# Altium project MiniPC MB GOST.PrjPcb (part 17 of 31)
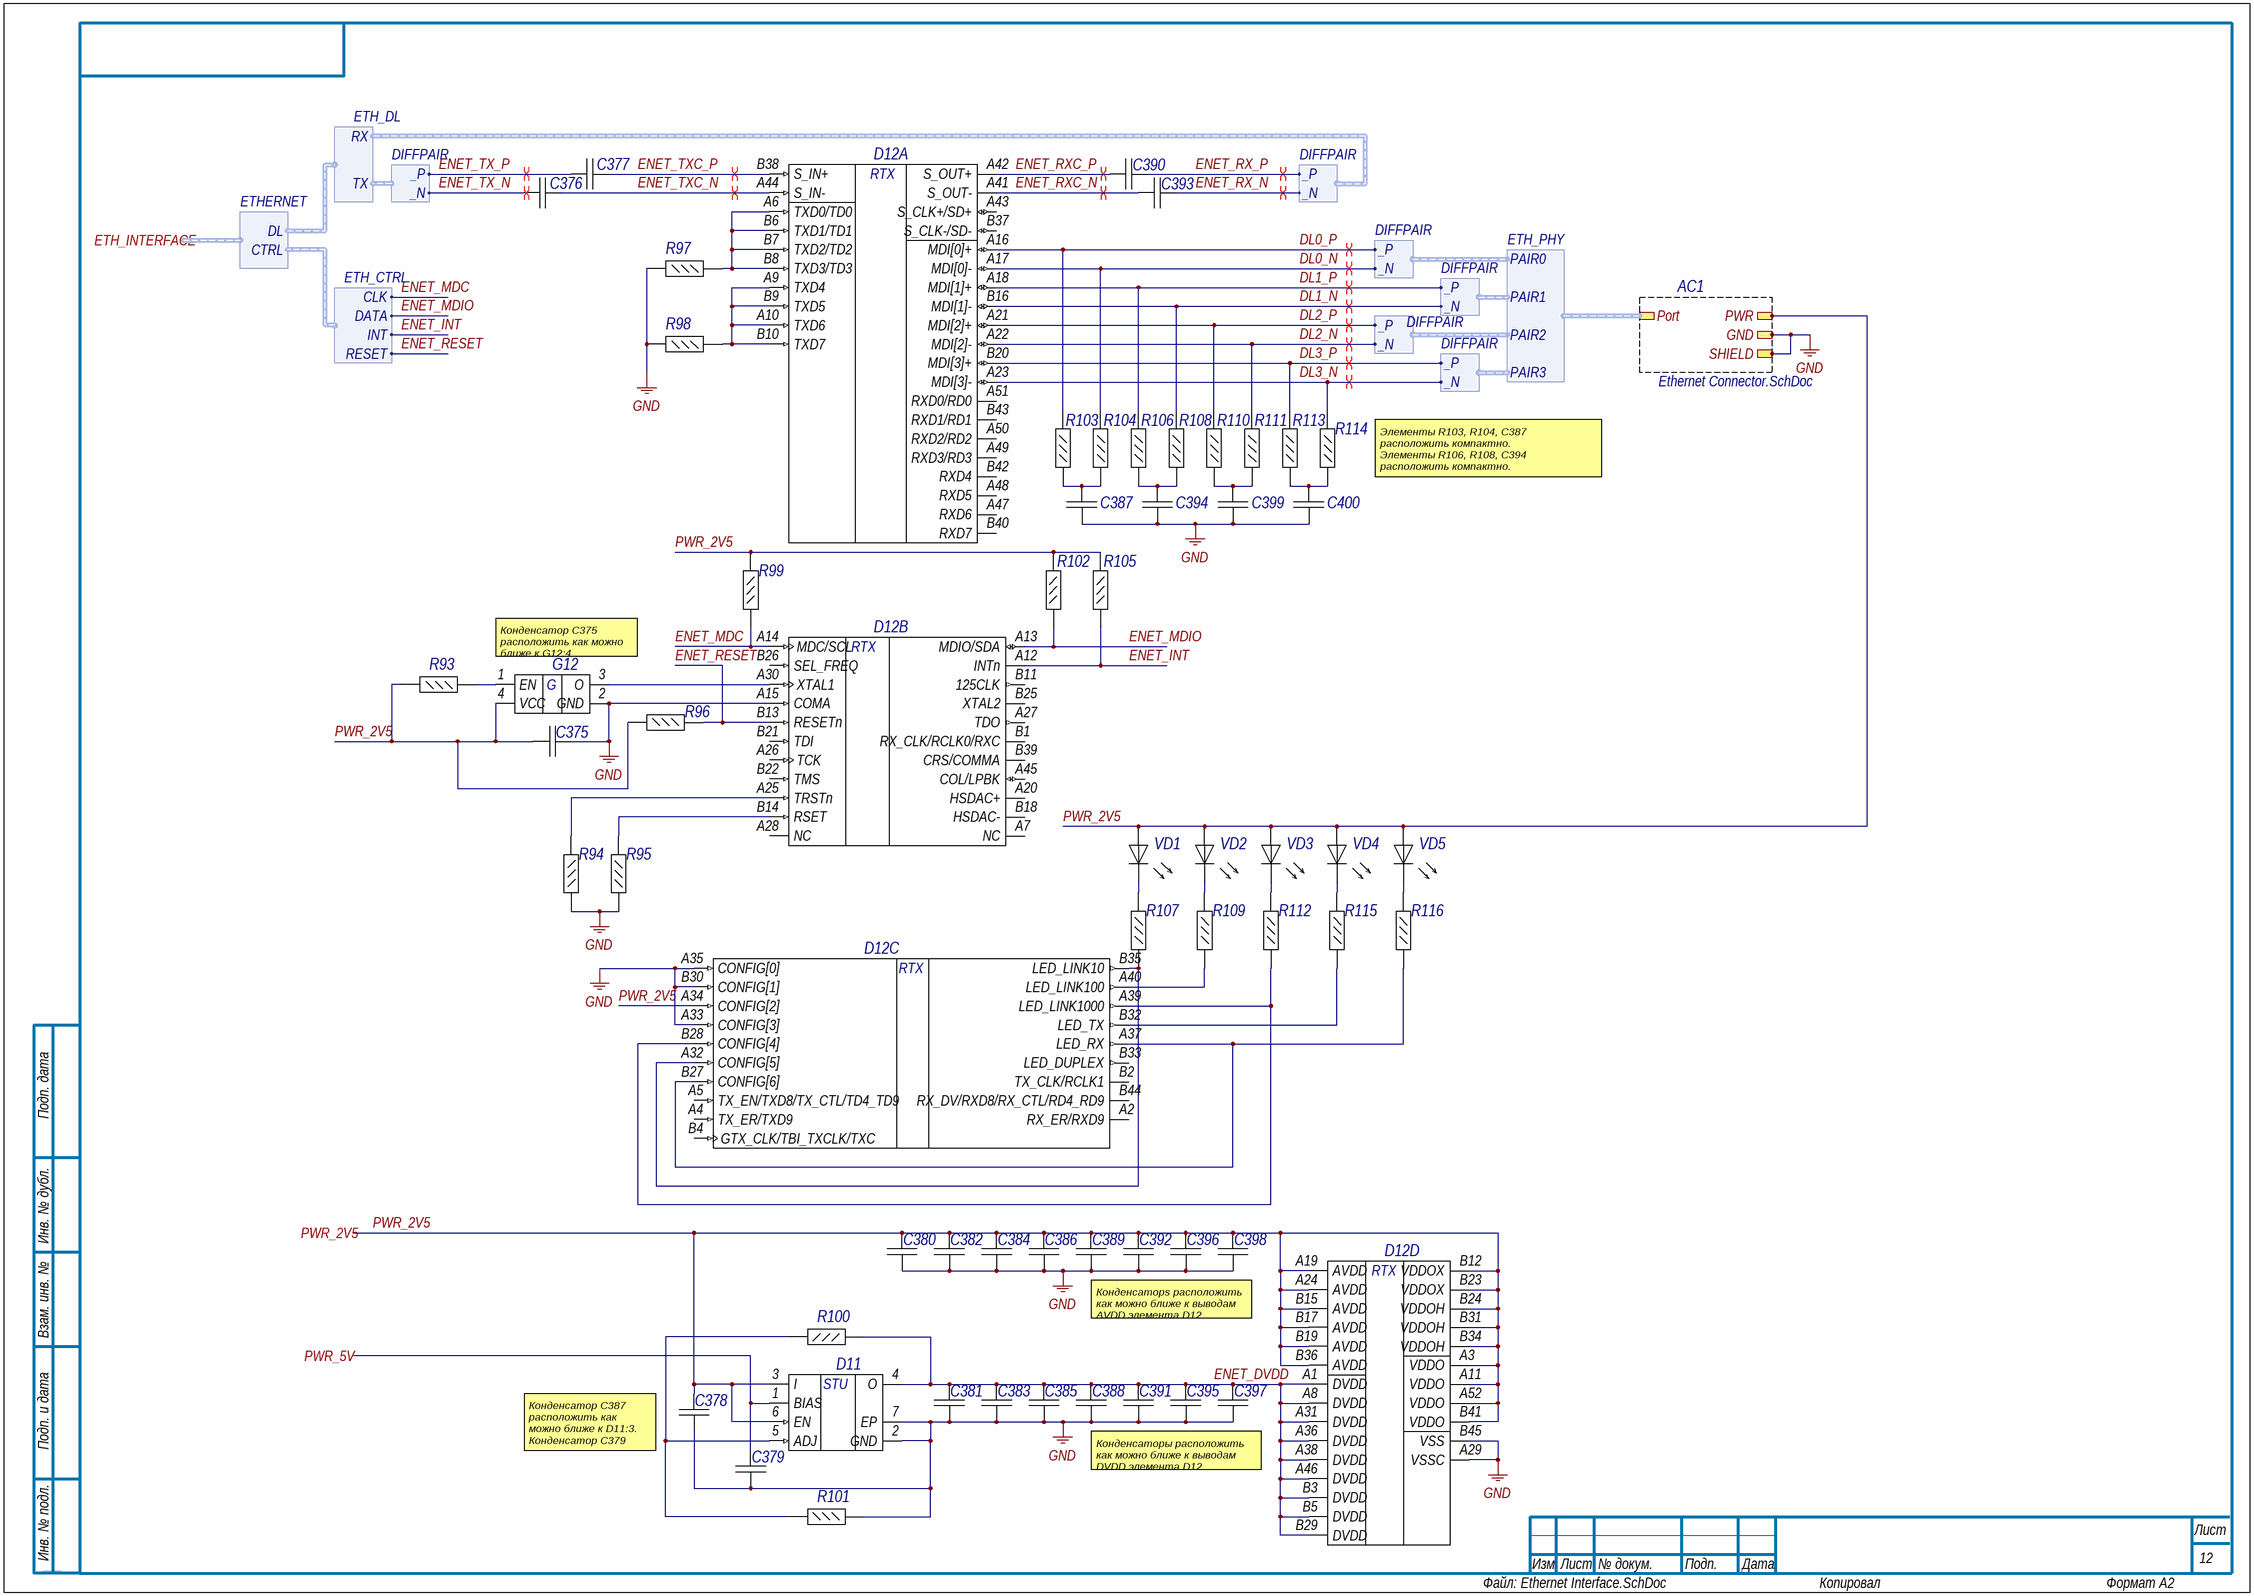
[diagram p47: Ethernet Interface.SchDoc]

## Sheet Ethernet Interface.SchDoc (continued)

### Library data of the parts (continued)
R115 = E95: Chip Resistor, 240 Ohm, +/- 1%, 100 mW, -55 to 155 degC, 0402 (1005 Metric), RoHS, Tape and Reel; Тип элемента: Резистор; Case\/Package: 0402; Voltage Rating: 50 V; Power Rating: 100 mW; Resistance: 240 Ohm; Old_des: R266; New_des: R134; UID: E95; Component Kind: Standard; Case Code (Imperial): 0402; Case Code (Metric): 1005; ComponentLink1Description: Manufacturer URL; ComponentLink1URL: http://www.panasonic.com/; ComponentLink2Description: Datasheet; ComponentLink2URL: http://industrial.panasonic.com/cdbs/www-data/pdf/RDA0000/AOA0000C86.pdf; DatasheetVersion: 04/2015; Length: 1 mm; Max Operating Temperature: 155 degC; Min Operating Temperature: -55 degC; Mounting Technology: Surface Mount; Package Quantity: 10000; PackageDescription: 2-Pin Surface Mount Device, Body 1 x 0.5 mm; Packaging: Tape and Reel; PartNumber: ERJ-2RKF2400X; RoHSCompliant: true; Tolerance: 1%; Width: 0.5 mm; Height: 0.35 mm; Mount: Surface Mount; PackageReference: 0402; Pins: 2; Radiation Hardening: No; REACH SVHC: Unknown
R116 = E95: Chip Resistor, 240 Ohm, +/- 1%, 100 mW, -55 to 155 degC, 0402 (1005 Metric), RoHS, Tape and Reel; Тип элемента: Резистор; Case\/Package: 0402; Voltage Rating: 50 V; Power Rating: 100 mW; Resistance: 240 Ohm; Old_des: R267; New_des: R135; UID: E95; Component Kind: Standard; Case Code (Imperial): 0402; Case Code (Metric): 1005; ComponentLink1Description: Manufacturer URL; ComponentLink1URL: http://www.panasonic.com/; ComponentLink2Description: Datasheet; ComponentLink2URL: http://industrial.panasonic.com/cdbs/www-data/pdf/RDA0000/AOA0000C86.pdf; DatasheetVersion: 04/2015; Length: 1 mm; Max Operating Temperature: 155 degC; Min Operating Temperature: -55 degC; Mounting Technology: Surface Mount; Package Quantity: 10000; PackageDescription: 2-Pin Surface Mount Device, Body 1 x 0.5 mm; Packaging: Tape and Reel; PartNumber: ERJ-2RKF2400X; RoHSCompliant: true; Tolerance: 1%; Width: 0.5 mm; Height: 0.35 mm; Mount: Surface Mount; PackageReference: 0402; Pins: 2; Radiation Hardening: No; REACH SVHC: Unknown
VD1 = E30: SMD mono-color Chip LED, WL-SMCW, Bright Green; Manufacturer: Wuerth Elektronik; Тип элемента: Светодиод; Old_des: D9; New_des: VD1; UID: E30; Component Kind: Standard; ComponentLink1Description: Manufacturer URL; ComponentLink1URL: http://www.we-online.com; ComponentLink2Description: Datasheet; ComponentLink2URL: http://katalog.we-online.com/led/datasheet/150060VS75000.pdf; PartNumber: 150060VS75000; PackageReference: 0603_A; Color: Bright Green
VD2 = E30: SMD mono-color Chip LED, WL-SMCW, Bright Green; Manufacturer: Wuerth Elektronik; Тип элемента: Светодиод; Old_des: D8; New_des: VD2; UID: E30; Component Kind: Standard; ComponentLink1Description: Manufacturer URL; ComponentLink1URL: http://www.we-online.com; ComponentLink2Description: Datasheet; ComponentLink2URL: http://katalog.we-online.com/led/datasheet/150060VS75000.pdf; PartNumber: 150060VS75000; PackageReference: 0603_A; Color: Bright Green
VD3 = E30: SMD mono-color Chip LED, WL-SMCW, Bright Green; Manufacturer: Wuerth Elektronik; Тип элемента: Светодиод; Old_des: D7; New_des: VD3; UID: E30; Component Kind: Standard; ComponentLink1Description: Manufacturer URL; ComponentLink1URL: http://www.we-online.com; ComponentLink2Description: Datasheet; ComponentLink2URL: http://katalog.we-online.com/led/datasheet/150060VS75000.pdf; PartNumber: 150060VS75000; PackageReference: 0603_A; Color: Bright Green
VD4 = E30: SMD mono-color Chip LED, WL-SMCW, Bright Green; Manufacturer: Wuerth Elektronik; Тип элемента: Светодиод; Old_des: D5; New_des: VD4; UID: E30; Component Kind: Standard; ComponentLink1Description: Manufacturer URL; ComponentLink1URL: http://www.we-online.com; ComponentLink2Description: Datasheet; ComponentLink2URL: http://katalog.we-online.com/led/datasheet/150060VS75000.pdf; PartNumber: 150060VS75000; PackageReference: 0603_A; Color: Bright Green
VD5 = E30: SMD mono-color Chip LED, WL-SMCW, Bright Green; Manufacturer: Wuerth Elektronik; Тип элемента: Светодиод; Old_des: D6; New_des: VD5; UID: E30; Component Kind: Standard; ComponentLink1Description: Manufacturer URL; ComponentLink1URL: http://www.we-online.com; ComponentLink2Description: Datasheet; ComponentLink2URL: http://katalog.we-online.com/led/datasheet/150060VS75000.pdf; PartNumber: 150060VS75000; PackageReference: 0603_A; Color: Bright Green

## Sheet Ethernet Connector.SchDoc
size 209 x 297 mm; Author: ALTIUM GOSTBOM2.0 KEV; SheetNumber: 13; SheetTotal: 48
Used 2 times, as channels A2/AB19/AC1, A2/AB20/AC1. Parts and nets are listed once, with the designators drawn on the sheet.
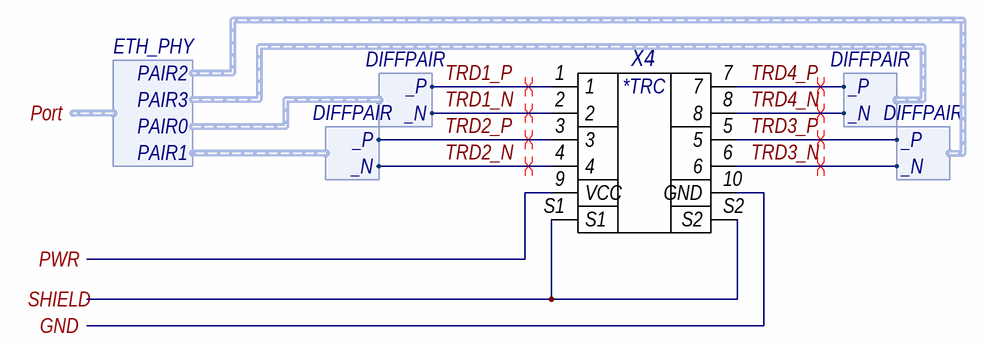
[diagram p22: Ethernet Connector.SchDoc]

### Parts
X4  7499111001A  [WE-7499111001A_V]  (value not drawn)

### Ports
GND, Port (harness ETH_PHY), PWR, SHIELD

### Harnesses
ETH_PHY: PAIR0, PAIR1, PAIR2, PAIR3
DIFFPAIR: _P, _N

### Nets
GND: X4.10(GND) ; port GND
PWR: X4.9(VCC) ; port PWR
SHIELD: X4.S1 X4.S2 ; port SHIELD
TRD1_N: X4.2 ; harness DIFFPAIR._N
TRD1_P: X4.1 ; harness DIFFPAIR._P
TRD2_N: X4.4 ; harness DIFFPAIR._N
TRD2_P: X4.3 ; harness DIFFPAIR._P
TRD3_N: X4.6 ; harness DIFFPAIR._N
TRD3_P: X4.5 ; harness DIFFPAIR._P
TRD4_N: X4.8 ; harness DIFFPAIR._N
TRD4_P: X4.7 ; harness DIFFPAIR._P

### Channels
A2/AB19/AC1: designators X4=AC1X4; ports GND=GND PWR=IO_2V5 SHIELD=GND
A2/AB20/AC1: designators X4=AC2X4; ports GND=GND PWR=IO_2V5 SHIELD=GND

### Layout directives
differential pair: DL0_N_AB19, DL0_P_AB19, DL1_N_AB19, DL1_P_AB19, DL2_N_AB19, DL2_P_AB19, DL3_N_AB19, DL3_P_AB19

### Notes on the sheet
- Подп. дата
- Инв. № дубл.
- Взам. инв. №
- Подп. и дата
- Инв. № подл.
- Изм.
- Лист
- № докум.
- Подп.
- Дата
- Файл:
- ALTIUM GOSTBOM2.0 KEV
- Копировал
- Формат А4
- (in symbol E37) *TRC

### Library data of the parts
X4 = E37: RJ45 LAN Transformer, Modular JACK, 0 to 70 degC, 10-Pin THD, RoHS, Tube; Тип элемента: Набор трансформаторов; UID: E37; Component Kind: Standard; ComponentLink1Description: Manufacturer URL; ComponentLink1URL: https://www.we-online.com/; ComponentLink2Description: Datasheet; ComponentLink2URL: https://katalog.we-online.de/pbs/datasheet/7499111001A.pdf; DatasheetVersion: Rev. 01; Mounting Technology: Through Hole; PackageDescription: 10-Pin Through Hole Device, Body 21.84 x 16 mm; PartNumber: 7499111001A; RoHSCompliant: False; ClassName: AB19, AB20, AC12

## Sheet Ethernet HPS Interface.SchDoc
size 420 x 297 mm; Author: ALTIUM GOSTBOM2.0 KEV; SheetNumber: 10; SheetTotal: 48
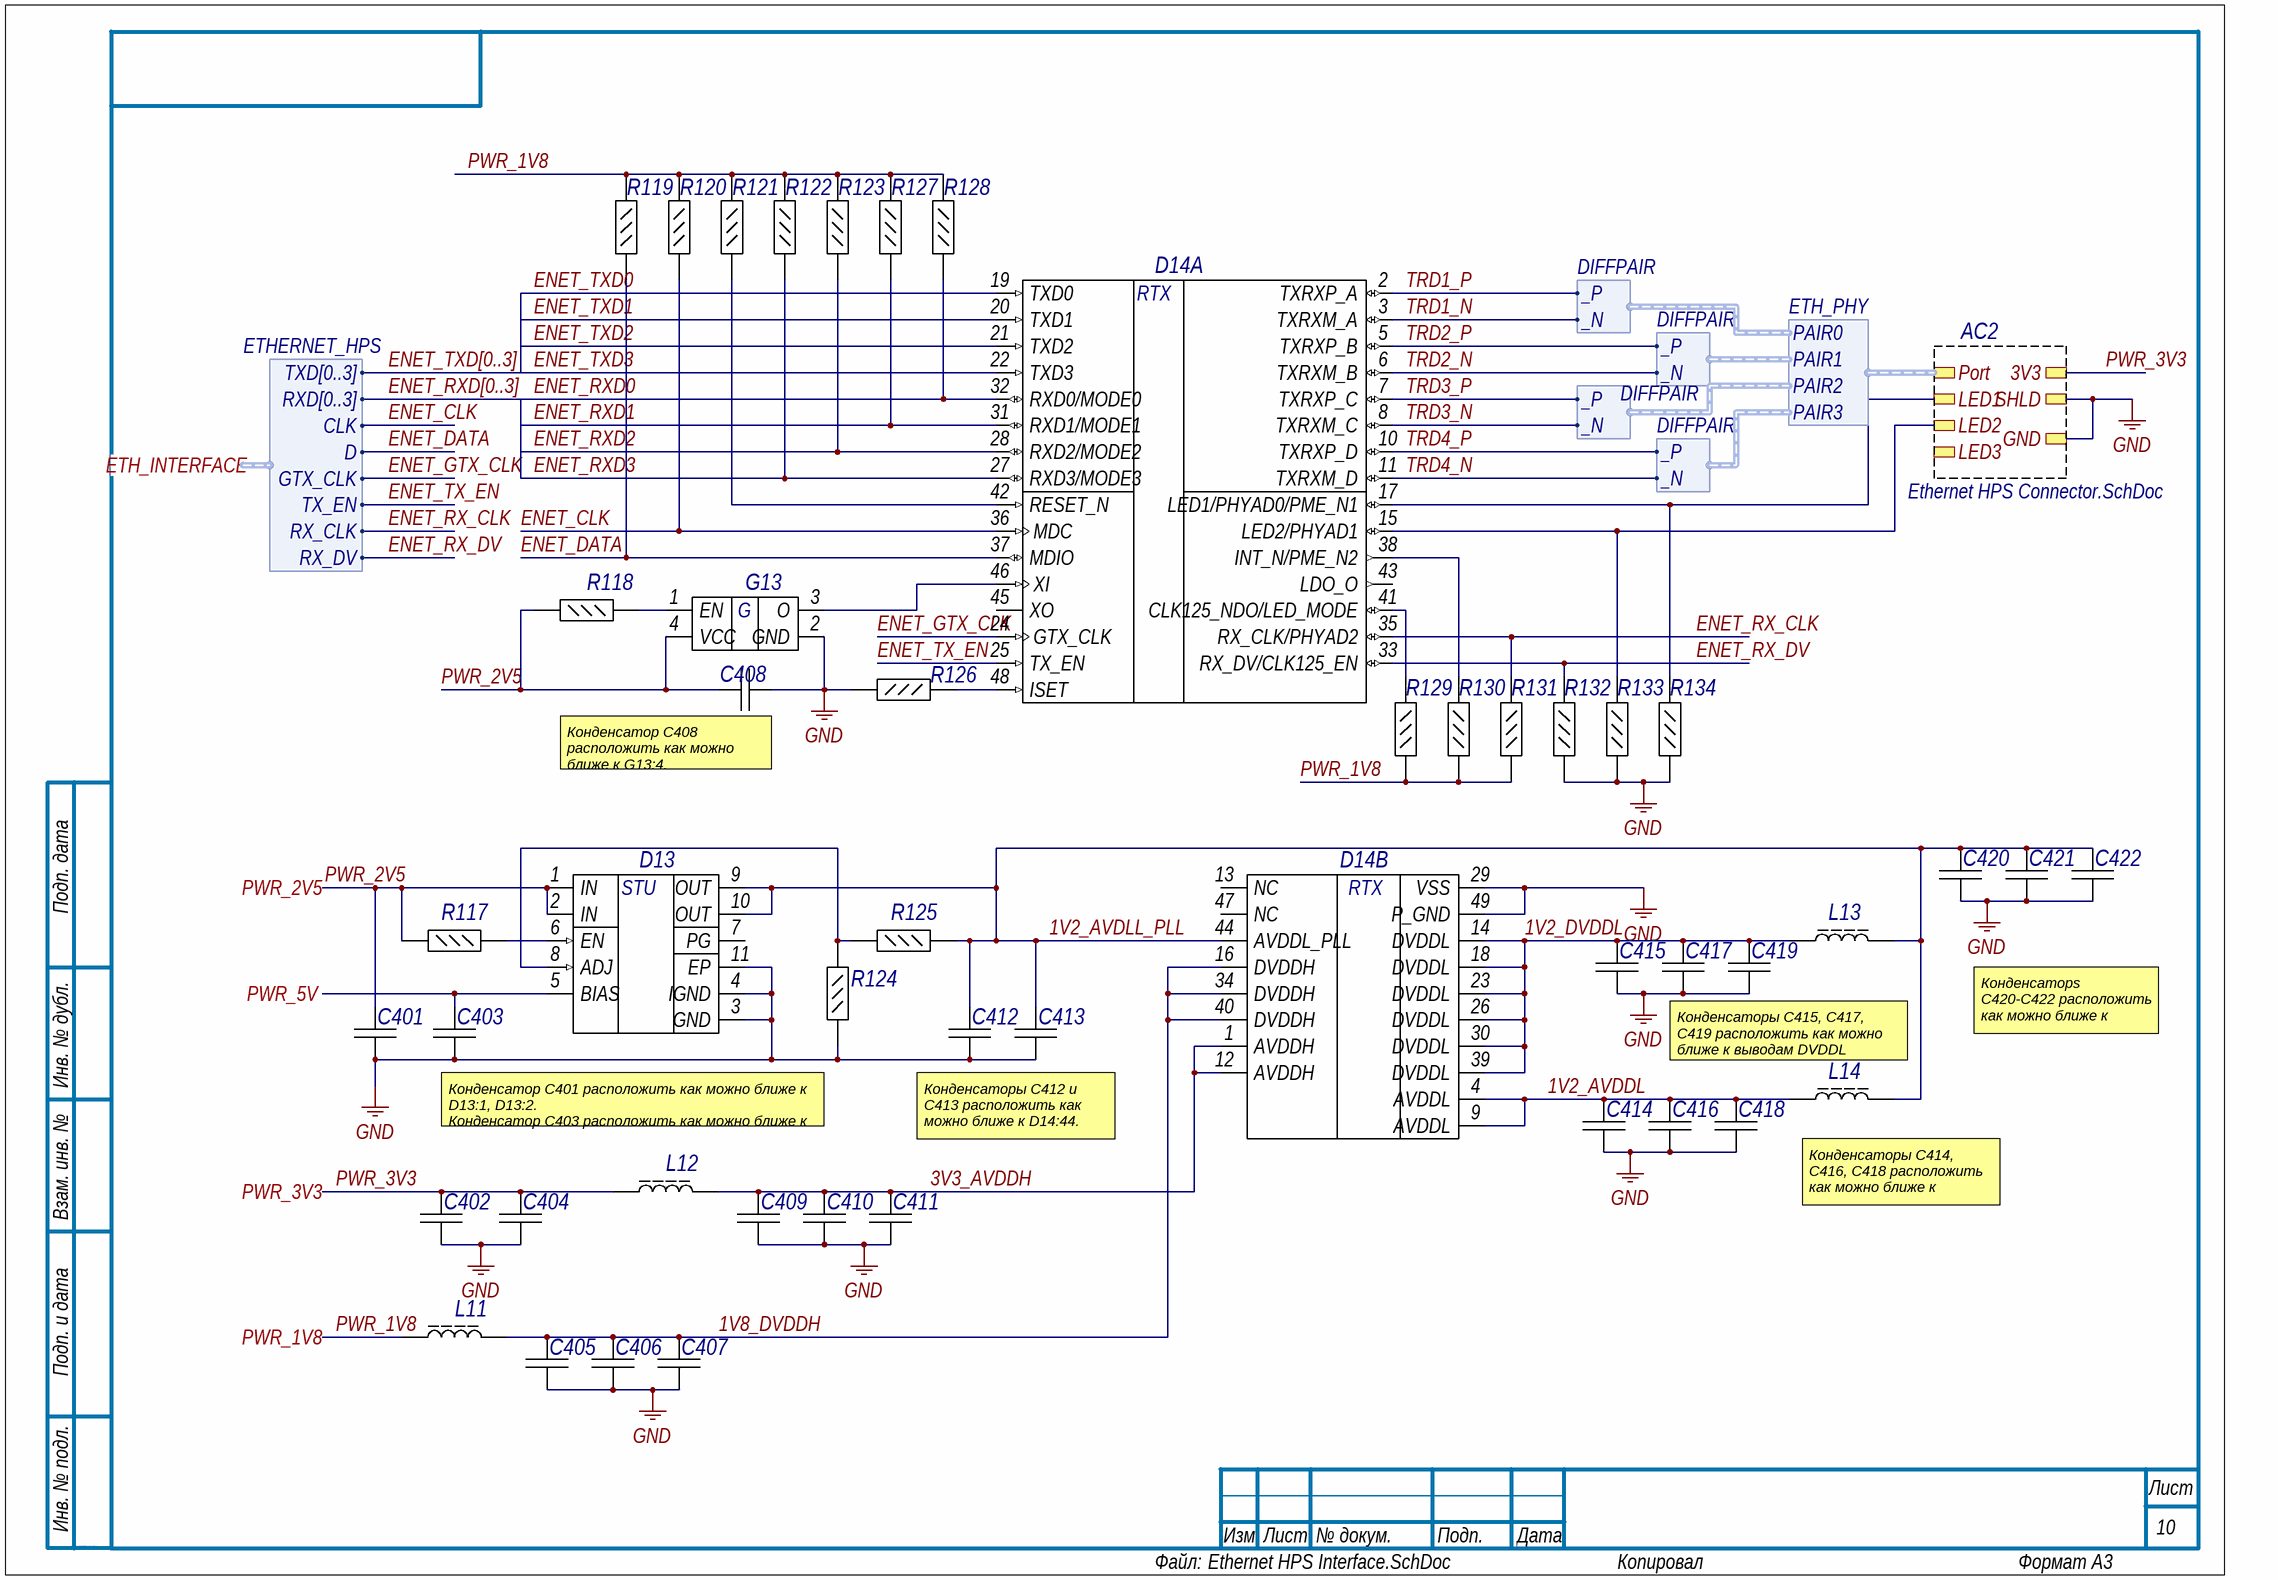
[diagram p23: Ethernet HPS Interface.SchDoc]

### Parts
C401  C2012X5R1C106K085AC  [CAPC2013X100X20NL20]  (value not drawn)
C402  C2012X5R1C106K085AC  [CAPC2013X100X20NL20]  (value not drawn)
C403  CGB2A1X5R1E105K033BC  [CAPC1005X33X10LL5]  (value not drawn)
C404  C2012X5R1C106K085AC  [CAPC2013X100X20NL20]  (value not drawn)
C405  GRM31CR61E226KE15L  [CAPC3216X180X55ML20T25]  (value not drawn)
C406  GRM188R61A225KE34x  [CAPC1608X90X35ML10T15]  (value not drawn)
C407  C1005X7R1E104M  [CAPC1005X55X10LL05]  (value not drawn)
C408  GRM155R71H103KA88D  [CAPC1005X55X25ML05T10]  (value not drawn)
C409  GRM31CR61E226KE15L  [CAPC3216X180X55ML20T25]  (value not drawn)
C410  GRM188R61A225KE34x  [CAPC1608X90X35ML10T15]  (value not drawn)
C411  C1005X7R1E104M  [CAPC1005X55X10LL05]  (value not drawn)
C412  GRM31CR61E226KE15L  [CAPC3216X180X55ML20T25]  (value not drawn)
C413  GRM188R61A225KE34x  [CAPC1608X90X35ML10T15]  (value not drawn)
C414  C1005X7R1E104M  [CAPC1005X55X10LL05]  (value not drawn)
C415  C1005X7R1E104M  [CAPC1005X55X10LL05]  (value not drawn)
C416  GRM188R61A225KE34x  [CAPC1608X90X35ML10T15]  (value not drawn)
C417  GRM188R61A225KE34x  [CAPC1608X90X35ML10T15]  (value not drawn)
C418  GRM31CR61E226KE15L  [CAPC3216X180X55ML20T25]  (value not drawn)
C419  GRM31CR61E226KE15L  [CAPC3216X180X55ML20T25]  (value not drawn)
C420  C1005X7R1E104M  [CAPC1005X55X10LL05]  (value not drawn)
C421  GRM188R61A225KE34x  [CAPC1608X90X35ML10T15]  (value not drawn)
C422  GRM31CR61E226KE15L  [CAPC3216X180X55ML20T25]  (value not drawn)
D13  LTC3026EDD-1#PBF  [LT-DD-10_V]  (value not drawn)
D14  KSZ9031RNXCA  [MICL-QFN-48_V]  (value not drawn)  (parts A,B of 2)
G13  SG-310SDF 25.0000M-B3  [EPSON-SG-310-4_V]  (value not drawn)
L11  742792609  [SMD-0603]  (value not drawn)
L12  742792609  [SMD-0603]  (value not drawn)
L13  742792609  [SMD-0603]  (value not drawn)
L14  742792609  [SMD-0603]  (value not drawn)
R117  ERJ-2RKF1002X  [RESC1005X40X25LL05T05]  (value not drawn)
R118  ERJ-2RKF1002X  [RESC1005X40X25LL05T05]  (value not drawn)
R119  NRC04F49R9TRF  [RESC1005X35X25NL8T10]  (value not drawn)
R120  ERJ-2RKF4701X  [RESC1005X40X25LL05T05]  (value not drawn)
R121  NRC04F49R9TRF  [RESC1005X35X25NL8T10]  (value not drawn)
R122  ERJ-2RKF4701X  [RESC1005X40X25LL05T05]  (value not drawn)
R123  ERJ-2RKF4701X  [RESC1005X40X25LL05T05]  (value not drawn)
R124  ERJ-2RKF1001X  [RESC1005X40X25LL05T05]  (value not drawn)
R125  ERJ-2RKF2001X  [RESC1005X40X25LL05T05]  (value not drawn)
R126  CRCW040212K1FKED  [RESC1005X40X25LL05T05]  (value not drawn)
R127  ERJ-2RKF4701X  [RESC1005X40X25LL05T05]  (value not drawn)
R128  ERJ-2RKF4701X  [RESC1005X40X25LL05T05]  (value not drawn)
R129  ERJ-2RKF4701X  [RESC1005X40X25LL05T05]  (value not drawn)
R130  ERJ-2RKF4701X  [RESC1005X40X25LL05T05]  (value not drawn)
R131  ERJ-2RKF4701X  [RESC1005X40X25LL05T05]  (value not drawn)
R132  ERJ-2RKF4701X  [RESC1005X40X25LL05T05]  (value not drawn)
R133  ERJ-2RKF4701X  [RESC1005X40X25LL05T05]  (value not drawn)
R134  ERJ-2RKF4701X  [RESC1005X40X25LL05T05]  (value not drawn)

### Sub-sheets
AC2 = Ethernet HPS Connector.SchDoc: Port (harness ETH_PHY), SHLD, LED1, LED2, LED3, 3V3, GND

### Ports
ETH_INTERFACE (harness ETHERNET_HPS), PWR_1V8, PWR_2V5, PWR_3V3, PWR_5V

### Harnesses
ETH_PHY: PAIR0, PAIR1, PAIR2, PAIR3
DIFFPAIR: _P, _N
ETHERNET_HPS: TXD[0..3], RXD[0..3], CLK, D, GTX_CLK, TX_EN, RX_CLK, RX_DV

### Nets
GND: C401.1 C402.1 C403.1 C404.1 C405.1 C406.1 C407.2 C408.1 C409.1 C410.1 C411.1 C412.1 C413.1 C414.1 C415.1 C416.1 C417.1 C418.1 C419.1 C420.1 C421.1 C422.1 D13.3(GND) D13.4(IGND) D13.11(EP) D14.29(VSS) D14.49(P_GND) G13.2(GND) R124.1 R126.2 R132.2 R133.2 R134.2 ; sheet AC2/SHLD, sheet AC2/GND
1V2_AVDDL: C414.2 C416.2 C418.2 D14.4(AVDDL) D14.9(AVDDL) L14.2  [project net 1V2_AVDDL_10]
1V2_AVDLL_PLL: C412.2 C413.2 C420.2 C421.2 C422.2 D13.9(OUT) D13.10(OUT) D14.44(AVDDL_PLL) L13.1 L14.1 R125.2  [project net 1V2_AVDLL_PLL_10]
1V2_DVDDL: C415.2 C417.2 C419.2 D14.14(DVDDL) D14.18(DVDDL) D14.23(DVDDL) D14.26(DVDDL) D14.30(DVDDL) D14.39(DVDDL) L13.2  [project net 1V2_DVDDL_10]
1V8_DVDDH: C405.2 C406.2 C407.1 D14.16(DVDDH) D14.34(DVDDH) D14.40(DVDDH) L11.2  [project net 1V8_DVDDH_10]
3V3_AVDDH: C409.2 C410.2 C411.2 D14.1(AVDDH) D14.12(AVDDH) L12.2  [project net 3V3_AVDDH_10]
ENET_CLK: D14.36(MDC) R120.1 ; port ETH_INTERFACE.CLK
ENET_DATA: D14.37(MDIO) R119.1 ; port ETH_INTERFACE.D
ENET_GTX_CLK: D14.24(GTX_CLK) ; port ETH_INTERFACE.GTX_CLK
ENET_RX_CLK: D14.35(RX_CLK/PHYAD2) R131.2 ; port ETH_INTERFACE.RX_CLK
ENET_RX_DV: D14.33(RX_DV/CLK125_EN) R132.1 ; port ETH_INTERFACE.RX_DV
ENET_RXD0: D14.32(RXD0/MODE0) R128.2  [project net ENET_RXD0_10]
ENET_RXD1: D14.31(RXD1/MODE1) R127.2  [project net ENET_RXD1_10]
ENET_RXD2: D14.28(RXD2/MODE2) R123.2  [project net ENET_RXD2_10]
ENET_RXD3: D14.27(RXD3/MODE3) R122.2  [project net ENET_RXD3_10]
ENET_TX_EN: D14.25(TX_EN) ; port ETH_INTERFACE.TX_EN
ENET_TXD0: D14.19(TXD0)  [project net ENET_TXD0_10]
ENET_TXD1: D14.20(TXD1)  [project net ENET_TXD1_10]
ENET_TXD2: D14.21(TXD2)  [project net ENET_TXD2_10]
ENET_TXD3: D14.22(TXD3)  [project net ENET_TXD3_10]
IO_5V: C403.2 D13.5(BIAS) ; port PWR_5V
PWR_1V8: L11.1 R119.2 R120.2 R121.2 R122.1 R123.1 R127.1 R128.1 R129.1 R130.2 R131.1 ; port PWR_1V8  [project net IO_1V8]
PWR_2V5: C401.2 C408.2 D13.1(IN) D13.2(IN) G13.4(VCC) R117.1 R118.1 ; port PWR_2V5  [project net IO_2V5]
PWR_3V3: C402.2 C404.2 L12.1 ; port PWR_3V3, sheet AC2/3V3  [project net IO_3V3]
TRD1_N: D14.3(TXRXM_A) ; harness DIFFPAIR._N
TRD1_P: D14.2(TXRXP_A) ; harness DIFFPAIR._P
TRD2_N: D14.6(TXRXM_B) ; harness DIFFPAIR._N
TRD2_P: D14.5(TXRXP_B) ; harness DIFFPAIR._P
TRD3_N: D14.8(TXRXM_C) ; harness DIFFPAIR._N
TRD3_P: D14.7(TXRXP_C) ; harness DIFFPAIR._P
TRD4_N: D14.11(TXRXM_D) ; harness DIFFPAIR._N
TRD4_P: D14.10(TXRXP_D) ; harness DIFFPAIR._P
NetD13_6: D13.6(EN) R117.2
NetD13_8: D13.8(ADJ) R124.2 R125.1
NetD14_15: D14.15(LED2/PHYAD1) R133.1 ; sheet AC2/LED2
NetD14_17: D14.17(LED1/PHYAD0/PME_N1) R134.1 ; sheet AC2/LED1
NetD14_38: D14.38(INT_N/PME_N2) R130.1
NetD14_41: D14.41(CLK125_NDO/LED_MODE) R129.2
NetD14_42: D14.42(RESET_N) R121.1
NetD14_46: D14.46(XI) G13.3(O)
NetD14_48: D14.48(ISET) R126.1
NetG13_1: G13.1(EN) R118.2

Not connected (* = marked no-connect by the designer): D13 7(PG); D14 13(NC) 43(LDO_O) 45(XO) 47(NC)

### Buses and harness runs
bus ENET_RXD[0..3]
bus ENET_TXD[0..3]

### Notes on the sheet
- (near C408) Конденсатор C408 расположить как можно ближе к G13:4.
- Конденсаторы C415, C417, C419 расположить как можно ближе к выводам DVDDL элемента D14.
- Конденсаторs C420-С422 расположить как можно ближе к D13:9-D13:10.
- Конденсатор C401 расположить как можно ближе к D13:1, D13:2.
  Конденсатор C403 расположить как можно ближе к D13:5.
- Конденсаторы C412 и C413 расположить как можно ближе к D14:44.
- (near L14) Конденсаторы C414, C416, C418 расположить как можно ближе к выводам AVDDL элемента D14.
- Подп. дата
- Инв. № дубл.
- Взам. инв. №
- Подп. и дата
- Инв. № подл.
- Изм.
- Лист
- № докум.
- Подп.
- Дата
- ALTIUM GOSTBOM2.0 KEV
- Файл:
- Копировал
- Формат А3
- (in symbol E111, part A) RTX
- (in symbol E111, part B) RTX
- (in symbol E117) G
- (in symbol E120) STU